# Altium schematic sheet MING RTD.SchDoc
size A3; SheetNumber: 1; SheetTotal: 1
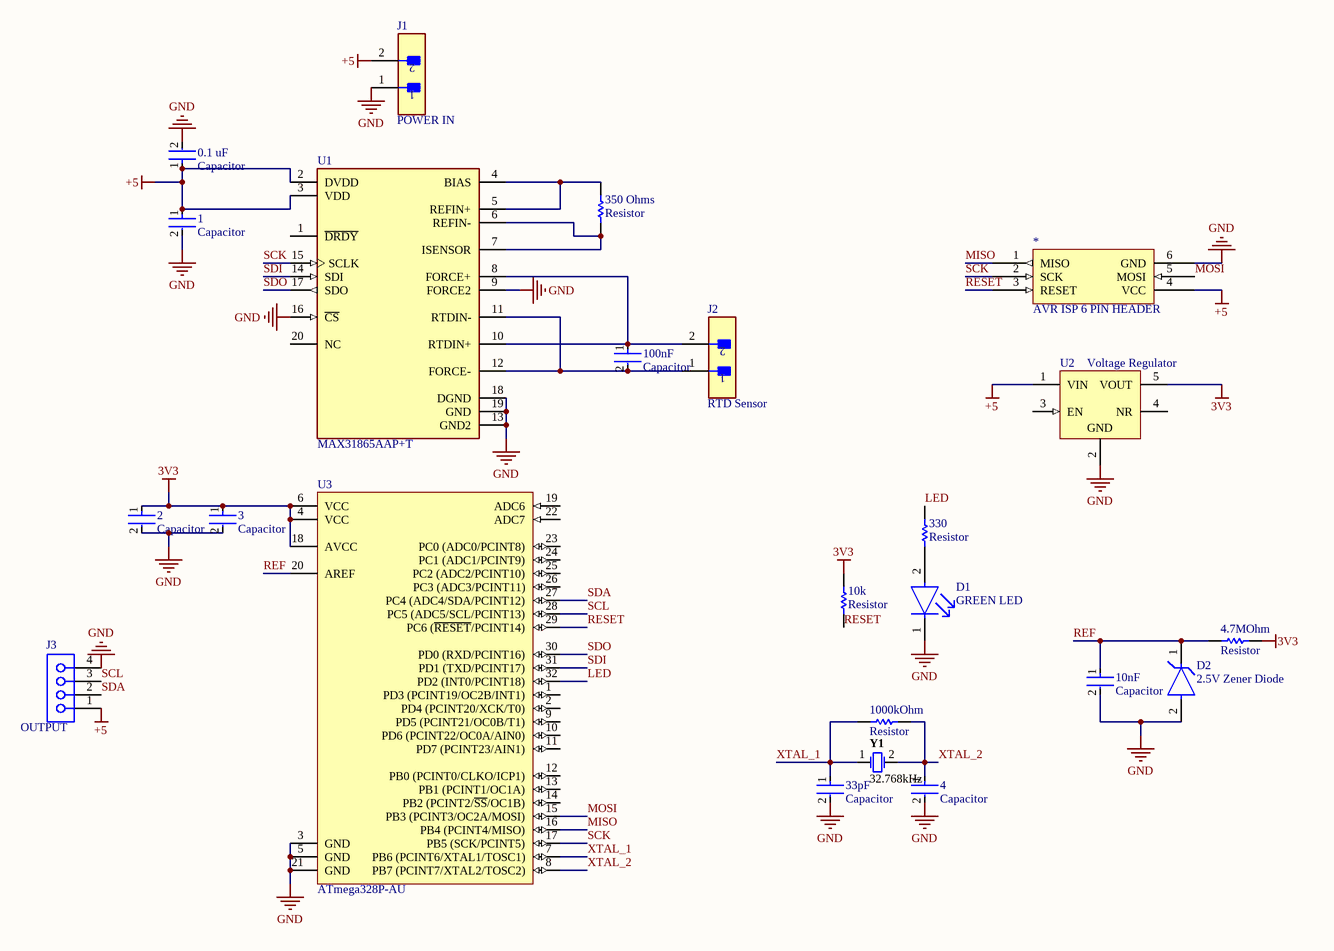
[diagram p0: MING RTD.SchDoc]

## Parts
0.1_uF  Capacitor  [FP-C0402-BB-MFG]
1  Capacitor  [FP-C0402-BB-MFG]
2  Capacitor  [FP-C0402-BB-MFG]
3  Capacitor  [FP-C0402-BB-MFG]
4  Capacitor  [FP-C0402-BB-MFG]
4.7MOhm  Resistor  [RESC1609X50X30NL8T20]
10k  Resistor  [RESC1609X50X30NL8T20]
10nF  Capacitor  [FP-C0402-BB-MFG]
33pF  Capacitor  [FP-C0402-BB-MFG]
100nF  Capacitor  [FP-C0402-BB-MFG]
330  Resistor  [RESC1609X50X30NL8T20]
350_Ohms  Resistor  [RESC1609X50X30NL8T20]
1000kOhm  Resistor  [RESC1609X50X30NL8T20]
*  AVR ISP 6 PIN HEADER
D1  GREEN LED  [FP-597-3301-507F-MFG]
D2  2.5V Zener Diode  [FP-425-04-IPC_B]
J1  POWER IN  [FP-B2B-XH-A_LF_SN-MFG]
J2  RTD Sensor  [FP-B2B-XH-A_LF_SN-MFG]
J3  OUTPUT  [SMTC-SLW-104-01-X-S]
U1  MAX31865AAP+T  [FP-A20-1-MFG]
U2  Voltage Regulator  [DBV0005A_N]
U3  ATmega328P-AU  [32A_L]
Y1  32.768kHz  [TXC-9HT10_V]

## Nets
3V3: 2.1 3.1 4.7MOhm.1 10k.2 U2.5(VOUT) U3.4(VCC) U3.6(VCC) U3.18(AVCC)
+5: 0.1_uF.1 1.1 *.4(VCC) J1.2 J3.1 U1.2(DVDD) U1.3(VDD) U2.1(VIN)
GND: 0.1_uF.2 1.2 2.2 3.2 4.2 10nF.2 33pF.2 *.6(GND) D1.1(C) D2.2(A) J1.1 J3.4 U1.9(FORCE2) U1.13(GND2) U1.16(~{CS}) U1.18(DGND) U1.19(GND) U2.2(GND) U3.3(GND) U3.5(GND) U3.21(GND)
LED: 330.1 U3.32(PD2_(INT0/PCINT18))
MISO: *.1(MISO) U3.16(PB4_(PCINT4/MISO))
MOSI: *.5(MOSI) U3.15(PB3_(PCINT3/OC2A/MOSI))
REF: 4.7MOhm.2 10nF.1 D2.1(C) U3.20(AREF)
RESET: 10k.1 *.3(RESET) U3.29(PC6_(~{RESET}/PCINT14))
SCK: *.2(SCK) U1.15(SCLK) U3.17(PB5_(SCK/PCINT5))
SCL: J3.3 U3.28(PC5_(ADC5/SCL/PCINT13))
SDA: J3.2 U3.27(PC4_(ADC4/SDA/PCINT12))
SDI: U1.14(SDI) U3.31(PD1_(TXD/PCINT17))
SDO: U1.17(SDO) U3.30(PD0_(RXD/PCINT16))
XTAL_1: 33pF.1 1000kOhm.2 U3.7(PB6_(PCINT6/XTAL1/TOSC1)) Y1.1
XTAL_2: 4.1 1000kOhm.1 U3.8(PB7_(PCINT7/XTAL2/TOSC2)) Y1.2
Net100nF_1: 100nF.1 J2.2 U1.8(FORCE+) U1.10(RTDIN+)
Net100nF_2: 100nF.2 J2.1 U1.11(RTDIN-) U1.12(FORCE-)
Net330_2: 330.2 D1.2(A)
Net350_Ohms_1: 350_Ohms.1 U1.6(REFIN-) U1.7(ISENSOR)
Net350_Ohms_2: 350_Ohms.2 U1.4(BIAS) U1.5(REFIN+)

Not connected (* = marked no-connect by the designer): U1 1(~{DRDY}) 20(NC); U2 3(EN) 4(NR); U3 1(PD3_(PCINT19/OC2B/INT1)) 2(PD4_(PCINT20/XCK/T0)) 9(PD5_(PCINT21/OC0B/T1)) 10(PD6_(PCINT22/OC0A/AIN0)) 11(PD7_(PCINT23/AIN1)) 12(PB0_(PCINT0/CLKO/ICP1)) 13(PB1_(PCINT1/OC1A)) 14(PB2_(PCINT2/~{SS}/OC1B)) 19(ADC6) 22(ADC7) 23(PC0_(ADC0/PCINT8)) 24(PC1_(ADC1/PCINT9)) 25(PC2_(ADC2/PCINT10)) 26(PC3_(ADC3/PCINT11))

## Library data of the parts
0.1_uF 1-4 10nF 33pF 100nF = CMP-2008-02046-2: CAP CER 0.1UF 10V X5R 0402; Manufacturer: Kemet; Manufacturer Part Number: C0402C104K8PACTU; Capacitance: 0.10 μF; Temperature Coefficient: 15%; Tolerance: 0.1; Value: 0.10 μF; Material: Ceramic; Package: C0402-BB; Temperature: -55°C to +125°C; ComponentLink2Description: Datasheet; Temperature Characteristic: X5R; Device Class L1: Passive Components; Height: 0.55mm; Lead Free: Yes; ComponentLink2URL: https://content.kemet.com/datasheets/KEM_C1002_X7R_SMD.pdf; Device Class L2: Capacitors; Temperature Range Low: -55°C; Temperature Range High: +125°C; RoHS: TRUE; Octopart: https://octopart.com/c0402c104k8pactu-kemet-140039; Automotive: No; Mouser Description: Capacitor 100 nF 10 VDC 0402; Category: Cap; Voltage Rating: 10 V; Digikey Description: CAP CER 0.1UF 10V X5R 0402; Ipc Land Pattern Name: CAPC10050X50; Device Class L3: Ceramic Capacitors
4.7MOhm 10k 330 350_Ohms 1000kOhm = CMP-2000-03816-5: Chip Resistor, 0 Ohm, Jumper, 100 mW, -55 to 155 degC, 0603 (1608 Metric), RoHS, Tape and Reel; Manufacturer: Vishay Semiconductor; Voltage Rating: 75 V; Package Quantity: 5000; DatasheetVersion: 06/2012; Min Operating Temperature: -55 degC; ComponentLink1URL: http://www.vishay.com/; Mounting Technology: Surface Mount; Height: 0.45 mm; ComponentLink1Description: Manufacturer URL; REACH SVHC: Unknown; PackageReference: 0603; Packaging: Tape and Reel; Max Operating Temperature: 155 degC; Mount: Surface Mount; ComponentLink2Description: Datasheet; PackageDescription: 2-Pin Surface Mount Device, Body 1.575 x 0.85 mm; Length: 1.55 mm; ComponentLink2URL: http://www.vishay.com/docs/20035/dcrcwe3.pdf; Pins: 2; RoHSCompliant: true
D1 = CMP-15384-000001-1: LED GREEN CLEAR 1208 SMD; Manufacturer: Dialight; Manufacturer Part Number: 597-3301-507F; Wavelength: 573nm; Luminous Intensity: 25mcd; Led Orientation: Top View; Power Dissipation: 70mW; Forward Current: 20mA; Viewing Angle: 110°; Forward Voltage: 2.2V; Peak Emmision Wavelength: 570nm; RoHS: TRUE; Temperature Range High: +85°C; Octopart: https://octopart.com/597-3301-507f-dialight-117926; Device Class L3: unset; Device Class L1: Optoelectronics; Automotive: No; Lead Free: Yes; Height: 1.5mm; ComponentLink2Description: Datasheet; Temperature Range Low: -30°C; Mouser Description: Standard LEDs - SMD Green 563nm 16mcd 2.2V 104 deg; Device Class L2: LEDs; Temperature: -30°C to +85°C; Package: 597-3301-507F; ComponentLink2URL: http://www.dialightsignalsandcomponents.com/Assets/Drawings/2D_Drawings_DrawingDetailedSpec/C17290.pdf; Category: Diode; Colour: Green; Digikey Description: LED GREEN CLEAR 1208 SMD
D2 = CMP-1060-00383-2: DIODE ZENER 2.5V 500MW SOD123; Peak Reverse Current: 100uA; Element Configuration: Single; Voltage Tolerance: 5%; Zener Current: 10mA; Impedance: 30R; Test Current: 20mA; Breakdown Voltage: 2.63V; Forward Voltage: 900mV; Lead Free: Lead Free; Zener Voltage: 2.5V; Package Quantity: 1; Max Power Dissipation: 500mW; Height: 1.12mm; Case/Package: SOD-123-2; Max Operating Temperature: 150°C; Voltage Rating (DC): 2.5V; Min Operating Temperature: -55°C; Radiation Hardening: No; Number of Pins: 2; Working Voltage: 2.5V; Max Reverse Leakage Current: 100uA; Packaging: Tape and Reel; Tolerance: 5%; Length: 2.69mm; REACH SVHC: No SVHC; Width: 1.6mm; Power Rating: 500mW; Power Dissipation: 500mW
J1 J2 = CMP-2000-05888-3: CONN HEADER VERT 2POS 2.5MM; Current Rating: 3A; Voltage Rating: 250V; Number of Contacts: 2; Contact Resistance: 20mR; Wire/Cable Gauge: 22AWG; Insulation Resistance: 1GR; Connector Type: Male Pin; Packaging: Bulk; Contact Material: Brass; Lead Free: Lead Free; Orientation: Straight; Contact Plating: Tin; Max Current Rating: 3A; Termination: Solder; Fastening Type: Detent; Depth: 5.75mm; Housing Material: Polyamide; REACH SVHC: No SVHC; Series: XH; Voltage Rating (AC): 250V; Number of Positions: 2; Color: Natural; Contact Type: Male Pin; Max Voltage Rating (DC): 250V; Pitch: 2.5mm; Lead Pitch: 2.5mm; Mount: Through Hole; Max Operating Temperature: 85°C; Length: 7.4mm; Max Voltage Rating (AC): 250V; Min Operating Temperature: -25°C; Number of Rows: 1; Housing Color: White
J3 = CMP-1023-00130-1: Low Profile Socket Strips, Through-hole, Vertical, -55 to 125 degC, 2.54 mm Pitch, 4-Pin, Female, RoHS; Manufacturer: Samtec; PartNumber: SLW-104-01-G-S; Pitch: 2.54 mm; PackageReference: SLW-104-01-X-S; Orientation: Vertical; ComponentLink1Description: Manufacturer URL; PackageVersion: X, 9/1987; RoHS: True; Temperature Range: -55 to 125 degC; DatasheetVersion: F-214; ComponentLink3URL: http://www.samtec.com/documents/webfiles/cpdf/SLW-1XX-01-X-X-MKT.pdf; Mounting Technology: Through-hole; PackageDescription: Low Profile Socket Strip; ComponentLink2Description: Datasheet; ComponentLink3Description: Package Specification; ComponentLink2URL: http://www.samtec.com/documents/webfiles/pdf/SLW.PDF; ComponentLink1URL: http://www.samtec.com
U1 = CMP-05687-000005-1: IC RTD TO DIGITAL CONVERT 20SSOP; Output Type: SPI; Min Operating Temperature: -40°C; Packaging: Tape and Reel; Mount: Surface Mount; Case/Package: SSOP; Max Operating Temperature: 125°C
U2 = CMP-0394-00176-2: Single Output Fast Transient Response LDO, 250 mA, Fixed 3.3 V Output, 1.8 to 12 V Input, 5-pin SOT-23 (DBV), -55 to 125 degC, Green (RoHS & no Sb/Br); Manufacturer: Texas Instruments; PartNumber: REG102NA-3.3/3K; Vin(Max)(V): 12; Accuracy(%): 1.5; Vin(Min)(V): 1.8; Vout Adj(Min)(V): 3.3; Iout(Max)(A): 0.25; Vdo(Typ)(mV): 150; SubFamily: Single Channel LDO; Iq(Typ)(mA): 0.4; DatasheetVersion: SBVS024F; PackageDescription: 5-Pin Plastic Small Outline, Body 1.60 Ãƒâ€” 2.90 mm, Pitch 0.95 mm; Code_JEDEC: MO-178; PackageReference: DBV0005A; PackageVersion: 4073253-4/K; Fixed Output Options(V): 3.3; Mounting Technology: Surface Mount; ComponentLink3Description: Package Specification; ComponentLink2Description: Datasheet; Vout Adj(Max)(V): 3.3; ComponentLink1URL: http://www.ti.com/; ComponentLink3URL: http://www.ti.com/litv/pdf/mpds018i; Eco-Plan: Green (RoHS & no Sb/Br); ComponentLink1Description: Manufacturer URL; ComponentLink2URL: http://www.ti.com/general/docs/lit/getliterature.tsp?genericPartNumber=REG102-33&fileType=pdf
U3 = ATmega328P-AU: 8-bit AVR Microcontroller, 32KB Flash, 1KB EEPROM, 2KB SRAM, 32-pin TQFP, Industrial Grade (-40°C to 85°C); PackageDescription: 32-Lead, 7x7x1.0 mm Body, 0.8mm Lead Pitch, Thin Profile Plastic Quad Flat Package (TQFP); DatasheetVersion: revD, May-2011; RevisionNote: DatasheetVersion & PackageVersion updated. URLs added.; ComponentLink1URL: http://www.atmel.com/; ComponentLink2Description: ATmega48A/48PA/88A/88PA/168A/168PA/328/328P Datasheet; Code_JEDEC: MS-026-ABA; ComponentLink1Description: Manufacturer URL; PackageReference: 32A; ComponentLink3Description: ATmega48A/48PA/88A/88PA/168A/168PA/328/328P Summary; ComponentLink2URL: http://www.atmel.com/dyn/resources/prod_documents/doc8271.pdf; PackageVersion: revC, Oct-2010; ComponentLink3URL: http://www.atmel.com/dyn/resources/prod_documents/8271S.pdf; Supplier 1: RSComponents; Supplier Part Number 1: 1310271
Y1 = CMP-1774-00002-2: Tuning Fork, 32.768 KHz, -40 to 85 degC, 2-Pin SMD, RoHS, Tape and Reel; Tolerance: 1%; Resistance: 220 kohm; Case\Package: 0603; Voltage Rating: 75 V; Power Rating: 100 mW; Package Quantity: 5000; ComponentLink1URL: http://www.txccrystal.com/images/pdf/9ht10.pdf; DatasheetVersion: Jun-11; Pins: 2; Mount: Surface Mount; Width: 0.8 mm; Height: 0.45 mm; PackageReference: 9HT10; Length: 1.6 mm; PackageDescription: 2-Pin Surface Mount Device, Body 3.2 x 1.5 mm; Radiation Hardening: No; ComponentLink1Description: Datasheet; RoHSCompliant: true; Case Code (Metric): 1608; REACH SVHC: Yes; Min Operating Temperature: -55 degC; Packaging: Tape and Reel; Max Operating Temperature: 155 degC; Case Code (Imperial): 0603